# EAGLE design tiny-usb-aaaf5050 (EAGLE 7.7.0)
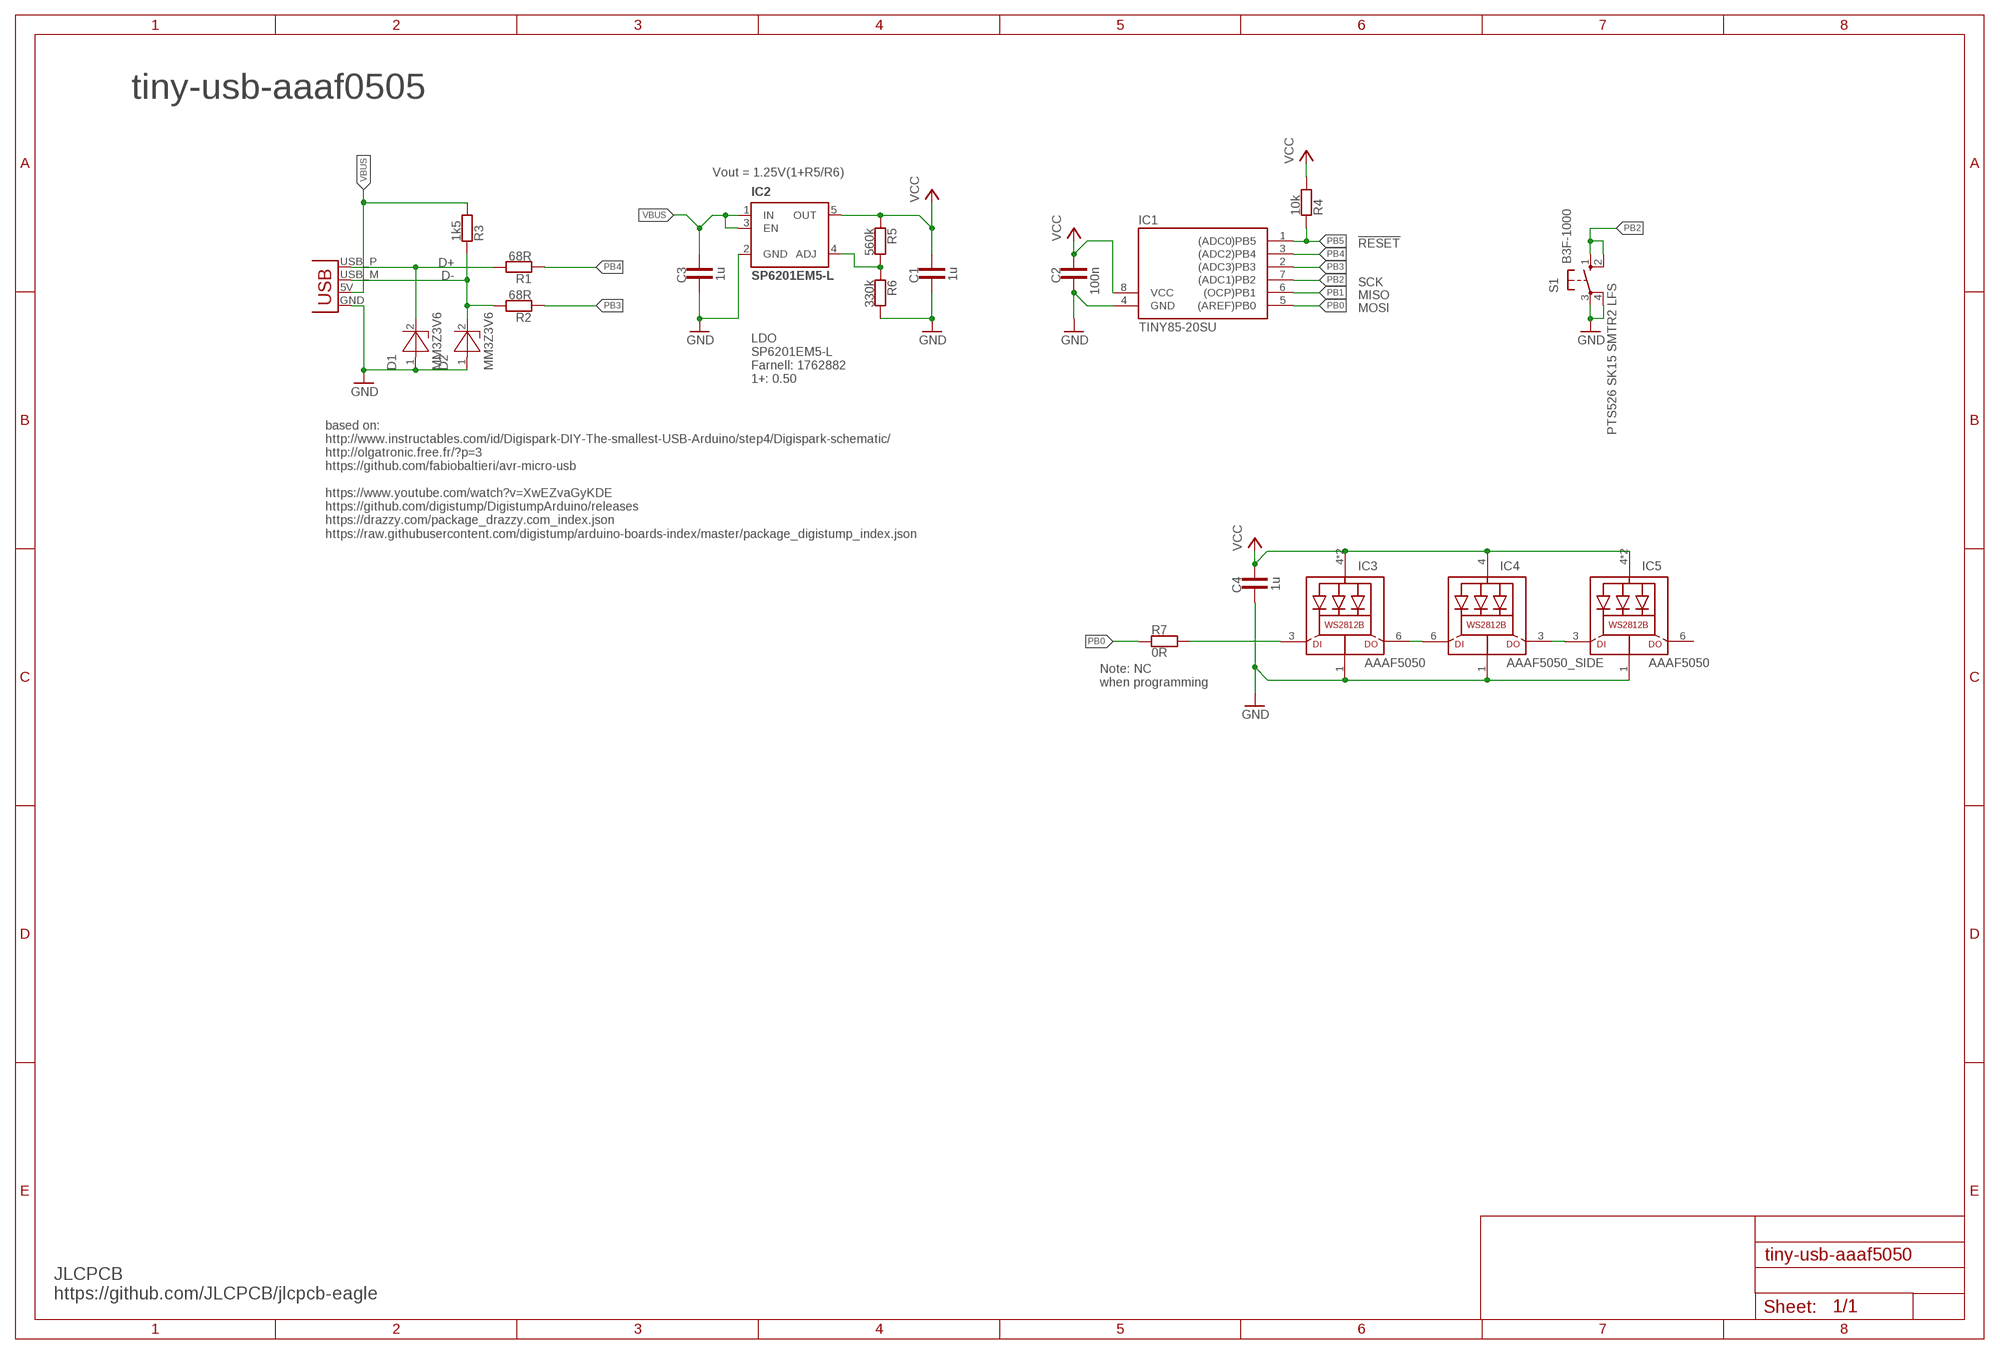
[diagram p0: schematic, sheet 1]

## Parts
C1  1u  C0603  [0603MIL]
C2  100n  C0603  [0603MIL]
C3  1u  C0603  [0603MIL]
C4  1u  C0805  [0805MIL]
D1  MM3Z3V6  [SOD-923F]
D2  MM3Z3V6  [SOD-923F]
IC1  TINY85-20SU  TINY25-20SU  [SOIC8]
IC2  SP6201EM5-L  [SOT23-5]
IC3  AAAF5050  [AAAF5050]
IC4  AAAF5050_SIDE  [AAAF5050_SIDE]
IC5  AAAF5050  [AAAF5050]
R1  68R  R0603  [0603MIL]
R2  68R  R0603  [0603MIL]
R3  1k5  R0603  [0603MIL]
R4  10k  R0603  [0603MIL]
R5  560k  R0603  [0603MIL]
R6  330k  R0603  [0603MIL]
R7  0R  R0603  [0603MIL]
S1  B3F-1000  10-XXSMD  [B3F-10SMD]
X1  USBPCB  [USB-A-PCB]

## Nets
D+: D1.2(K) R1.2 X1.USB_P(D+)
D-: D2.2(K) R2.2 R3.1 X1.USB_M(D-)
DIN1: IC3.3(DI) R7.2
DIN2: IC3.6(DO) IC4.6(DI)
DIN3: IC4.3(DO) IC5.3(DI)
GND: C1.2 C2.2 C3.2 C4.2 D1.1(A) D2.1(A) IC1.4(GND) IC2.2(GND) IC3.1(GND) IC4.1(GND) IC5.1(GND) R6.2 S1.3(P) S1.4(P1) X1.GND
N$1: IC2.4(ADJ) R5.2 R6.1
PB0: IC1.5((AREF)PB0) R7.1
PB1: IC1.6((OCP)PB1)
PB2: IC1.7((ADC1)PB2) S1.1(S) S1.2(S1)
PB3: IC1.2((ADC3)PB3) R2.1
PB4: IC1.3((ADC2)PB4) R1.1
PB5: IC1.1((ADC0)PB5) R4.1
VBUS: C3.1 IC2.1(IN) IC2.3(EN) R3.2 X1.5V(VBUS)
VCC: C1.1 C2.1 C4.1 IC1.8(VCC) IC2.5(OUT) IC3.4(VDD) IC3.5(VDD) IC4.4(VDD) IC5.4(VDD) IC5.5(VDD) R4.2 R5.1
Unconnected: IC5.6(DO)

## Notes on the sheet
- tiny-usb-aaaf0505
- Vout = 1.25V(1+R5/R6)
- !RESET!
- SCK
- MISO
- MOSI
- LDO
  SP6201EM5-L
  Farnell: 1762882
  1+: 0.50
- PTS526 SK15 SMTR2 LFS
- based on:
  http://www.instructables.com/id/Digispark-DIY-The-smallest-USB-Arduino/step4/Digispark-schematic/
  http://olgatronic.free.fr/?p=3
  https://github.com/fabiobaltieri/avr-micro-usb
  
  https://www.youtube.com/watch?v=XwEZvaGyKDE
  https://github.com/digistump/DigistumpArduino/releases
  https://drazzy.com/package_drazzy.com_index.json
  https://raw.githubusercontent.com/digistump/arduino-boards-index/master/package_digistump_index.json
- Note: NC 
  when programming
- JLCPCB
  https://github.com/JLCPCB/jlcpcb-eagle

## Library data of the parts
C1-C4 = tiny:C: C Kondensator im Chip-Gehäuse
D1 D2 = tiny:MM3Z3V6
IC1 = avr-5:TINY25
IC2 = tiny:SP6201
IC3-IC5 = tiny:AAAF5050
R1-R7 = tiny:R: R Widerstand im Chip-Gehäuse
S1 = tiny:10-XX: OMRON SWITCH
X1 = sparkfun:USB: USB Connectors USB-B-PTH is fully proven SKU : PRT-00139 USB-miniB is fully proven SKU : PRT-00587 USB-A-PCB is untested. USB-A-H is throughly reviewed, but untested. Spark Fun Electronics SKU : PRT-00437 USB-B-SMT is throughly reviewed, but untested. Needs silkscreen touching up. USB-A-S has not been used/tested USB-MB-H has not been used/tested

## Board
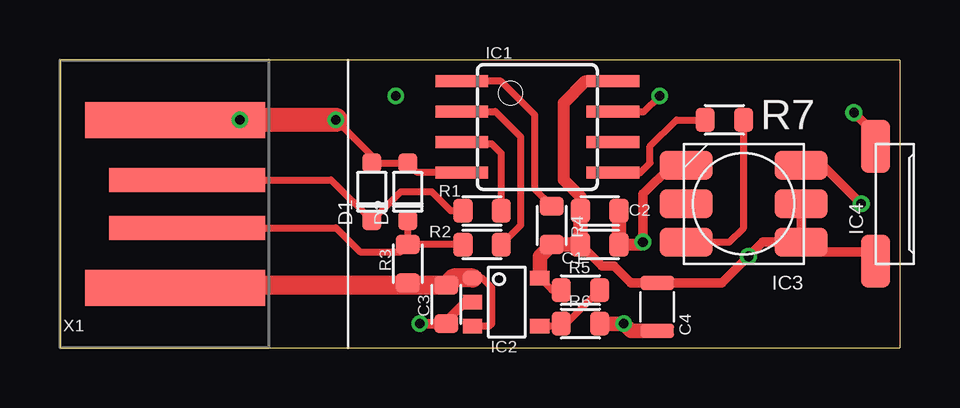
[diagram p1: board, top side]
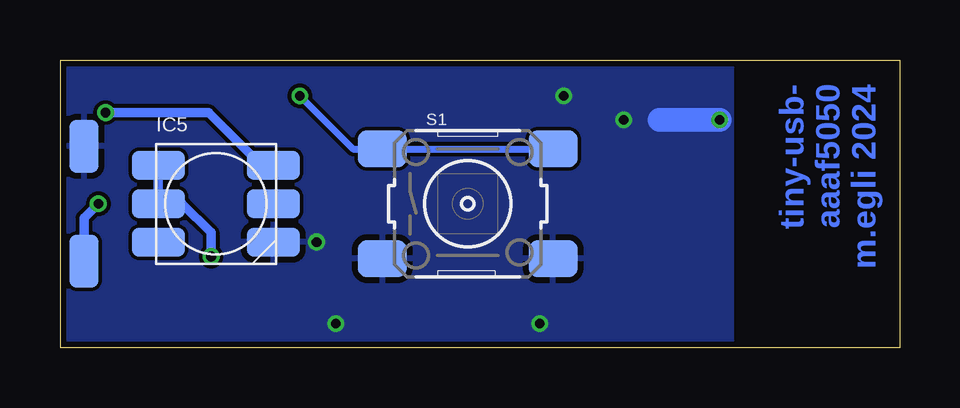
[diagram p2: board, bottom side, seen from below]

Size 35 x 12 mm. Coordinates in mm from the lower left corner, seen from the top.
Outline: 0,0 35,0 35,12 0,12 0,0
Copper layers (1*16): Top 0.035mm / dielectric 1.5mm / Bottom 0.035mm
Design rules "SeeedStudio_DRU-2layer_no_angle_20130527": minimum track width 6mil, minimum drill 12mil, track to track 6mil, track to pad 6mil, pad to pad 6mil, via to via 6mil, smd to smd 0mil, copper to edge 10mil, drill to drill 10mil, minimum pad ring 10mil, minimum via ring 6mil, stop-mask expansion 2mil, vias tented up to drill 25mil, thermal gap 10mil

### Footprints (pad centres in the part's own frame; a part is rotated, then mirrored left to right if it is on the bottom)
0603MIL = smd 0.8 x 1: 1 -0.8,0; 2 0.8,0
0805MIL = smd 0.6 x 1.4: 1 1,0; 2 -1,0
SOD-923F = smd 0.8 x 0.8: 1 1.2,0; 2 -1.2,0
SOIC8 = smd 0.5 x 2.2: 1 -1.905,-3.154; 2 -0.645,-3.154; 3 0.625,-3.154; 4 1.895,-3.154; 5 1.905,3.154; 6 0.635,3.154; 7 -0.635,3.154; 8 -1.905,3.154
SOT23-5 = smd 0.8 x 0.6: 1 -1.4,1; 2 -1.4,0; 3 -1.4,-1; 4 1.4,-1; 5 1.4,1
AAAF5050 = smd 2.2 x 1.2: 1 2.4,-1.6; 2 2.4,0; 3 2.4,1.6; 4 -2.4,1.6; 5 -2.4,0; 6 -2.4,-1.6
AAAF5050_SIDE = smd 2.2 x 1.2 bottom: 1 2.4,0; 6 -2.4,0 | smd 2.2 x 1.2: 3 2.4,0; 4 -2.4,0
B3F-10SMD = smd 2.032 x 1.524: 1 -3.556,2.286; 2 3.556,2.286; 3 -3.556,-2.286; 4 3.556,-2.286
USB-A-PCB = smd 7.5 x 1.5: 5V -0.2,-3.5; GND -0.2,3.5 | smd 6.5 x 1: USB_M 0.3,-1; USB_P 0.3,1

### Placement (x,y rotation side)
C1  22.5,4.3 0 top
C2  22.5,5.7 0 top
C3  16.1,1.8 270 top
C4  24.9,1.7 90 top
D1  13,6.5 90 top
D2  14.5,6.5 90 top
IC1  19.9,9.2 270 top
IC2  18.6,1.9 0 top
IC3  28.5,6 180 top
IC4  34,6 90 top
IC5  28.5,6 0 bottom
R1  17.6,5.7 180 top
R2  17.6,4.3 180 top
R3  14.5,3.5 270 top
R4  20.5,5.1 270 top
R5  21.7,2.4 0 top
R6  21.7,1 0 top
R7  27.7,9.5 0 top
S1  18,6 0 bottom
X1  5,6 0 top

### Tracks (layer width: path | path; a pad name or v marks a point on that pad's centre or on a via)
D+
  Top 0.3: R1.2 16.3,5.7 15.5,6.5 14.2,6.5 D1.2 11.3,7 X1.USB_P
D-
  Top 0.3: X1.USB_M 11.5,5 12.5,4 14.2,4 R3.1 | R3.1 D2.2 | R2.2 R3.1
DIN1
  Top 0.3: IC3.3 27.9,4.4 28.5,5 R7.2
DIN2  (via drill 0.4)
  Top 0.4: v33.4,6 31.8,7.6 IC3.6
  Bottom 0.4: IC4.6 34,5.4 v33.4,6
DIN3  (via drill 0.4)
  Top 0.4: IC4.3 34,8.9 v33.1,9.8
  Bottom 0.4: IC5.3 26.6,7.6 28.8,9.8 v33.1,9.8
GND  (via drill 0.4)
  Top 0.3: IC1.4 14.89,7.3 D2.1 D1.1 13,8 v11.5,9.5 | 16.1,1.1 C3.2
  Top 0.4: IC2.2 16.9,1.9 16.1,1.1 | C3.2 v15,1 | IC3.1 25.5,7.6 24.3,6.4 v24.3,4.4
  Top 0.5: C1.2 24.2,4.3 v24.3,4.4
  Top 0.6: C2.2 C1.2 | C4.2 23.8,0.7 v23.5,1 R6.2
  Top 1: X1.GND v7.5,9.5 v11.5,9.5
  Bottom 1: v7.5,9.5 10,9.5
  other vias: 14,10.5
  pour Bottom: 7,12 39.3,12 39.3,0 7,0
N$1
  Top 0.3: IC2.4 20.8,0.9 R6.1 21.1,1 R5.2
PB0
  Top 0.3: IC1.5 24.2,7.29 24.6,7.7 24.6,8.4 25.7,9.5 R7.1
PB2  (via drill 0.4)
  Top 0.3: IC1.7 24.34,9.84 v25,10.5
  Bottom 0.3: v25,10.5 22.79,8.29 S1.1 S1.2
PB3
  Top 0.3: IC1.2 18.16,9.85 19.2,8.8 19.2,5.1 R2.1
PB4
  Top 0.3: R1.1 18.4,8.1 18,8.5 16.82,8.5 IC1.3
PB5
  Top 0.3: IC1.1 18.39,11.11 19.8,9.7 19.8,6.6 R4.1
VBUS
  Top 0.3: IC2.3 17.9,0.9 18,1 18,2.5 17.6,2.9 IC2.1
  Top 0.8: 14.5,2.6 C3.1 16.4,2.9 IC2.1 | 14.5,2.6 8.1,2.6 8,2.5 X1.5V | R3.2 14.5,2.6
VCC  (via drill 0.4)
  Top 0.3: R5.1 20.5,2.4 IC2.5
  Top 0.4: C1.1 22.6,3.4 23.1,3.4 23.8,2.7 C4.1 27.6,2.7 v28.7,3.8 29.3,4.4 IC3.4 | IC3.4 IC5.5 | IC4.4 33.6,4 31.8,4 31.4,4.4 IC3.4
  Top 0.5: C2.1 21.7,6.3 21,7 21,10.2 21.91,11.11 IC1.8
  Top 0.6: IC2.5 20,3.8 R4.2 C1.1 C2.1
  Bottom 0.4: IC5.4 IC5.5 29.9,6 28.7,4.8 v28.7,3.8

### Text on the board
Bottom: tiny-usb- / aaaf5050 / m.egli 2024